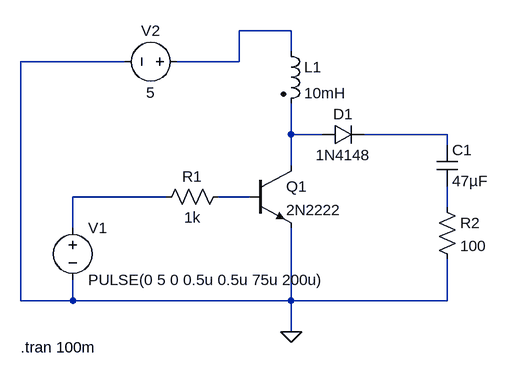
[diagram p0: schematic part6.asc]
part6.asc, the LTspice schematic file:
Version 4
SHEET 1 880 680
WIRE 224 -80 144 -80
WIRE 224 -48 224 -80
WIRE -32 -32 -192 -32
WIRE 144 -32 144 -80
WIRE 144 -32 48 -32
WIRE 224 80 224 32
WIRE 272 80 224 80
WIRE 464 80 336 80
WIRE 464 96 464 80
WIRE 224 128 224 80
WIRE 32 176 -112 176
WIRE 160 176 112 176
WIRE 464 192 464 160
WIRE -112 224 -112 176
WIRE -192 336 -192 -32
WIRE -112 336 -112 304
WIRE -112 336 -192 336
WIRE 224 336 224 224
WIRE 224 336 -112 336
WIRE 464 336 464 272
WIRE 464 336 224 336
WIRE 224 384 224 336
FLAG 224 384 0
SYMBOL res 128 160 R90
WINDOW 0 0 56 VBottom 2
WINDOW 3 32 56 VTop 2
SYMATTR InstName R1
SYMATTR Value 1k
SYMBOL res 448 176 R0
SYMATTR InstName R2
SYMATTR Value 100
SYMBOL cap 448 96 R0
SYMATTR InstName C1
SYMATTR Value 47µF
SYMBOL ind2 208 -64 R0
SYMATTR InstName L1
SYMATTR Value 10mH
SYMATTR Type ind
SYMBOL npn 160 128 R0
SYMATTR InstName Q1
SYMATTR Value 2N2222
SYMBOL diode 272 96 R270
WINDOW 0 32 32 VTop 2
WINDOW 3 0 32 VBottom 2
SYMATTR InstName D1
SYMATTR Value 1N4148
SYMBOL voltage -112 208 R0
WINDOW 123 0 0 Left 2
WINDOW 39 0 0 Left 2
SYMATTR InstName V1
SYMATTR Value PULSE(0 5 0 0.5u 0.5u 75u 200u)
SYMBOL voltage 64 -32 R90
WINDOW 0 -32 56 VBottom 2
WINDOW 3 32 56 VTop 2
SYMATTR InstName V2
SYMATTR Value 5
TEXT -192 408 Left 2 !.tran 100m

The netlist it stands for:
* part6.asc
R1 N005 N004 1k
R2 N006 0 100
C1 N003 N006 47µF
L1 N001 N002 10mH
Q1 N002 N005 0 0 2N2222
D1 N002 N003 1N4148
V1 N004 0 PULSE(0 5 0 0.5u 0.5u 75u 200u)
V2 N001 0 5
.model D D
.lib standard.dio
.model NPN NPN
.model PNP PNP
.lib standard.bjt
.tran 100m
.backanno
.end